# Altium project DC_DC_BuckConverter.PrjPcb
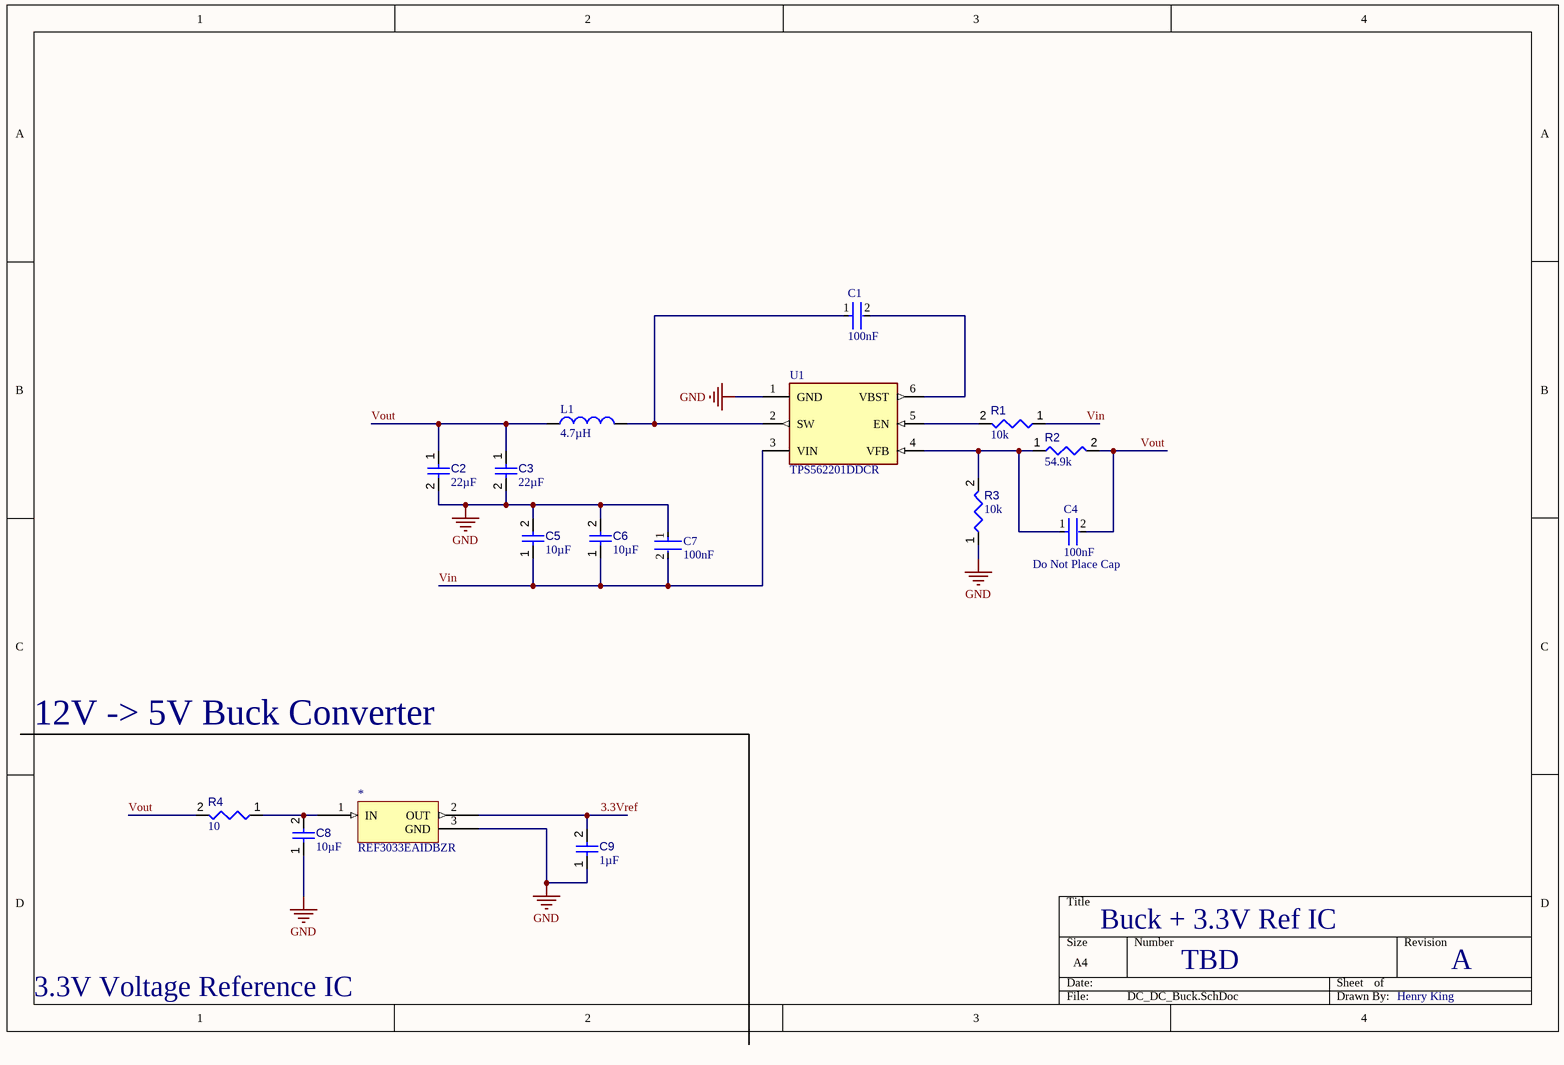
[diagram p0: DC_DC_Buck.SchDoc]
1 sheet, 16 parts. Net scope: global (net labels, ports and power ports of the same name join across sheets).
Board file: DC_DC_Buck.PcbDoc

## Sheet DC_DC_Buck.SchDoc
size A4; SheetNumber: 1; SheetTotal: 1; SPICEModelCacheDHIRAOPG: <root> / <DocumentId>DHIRAOPG</DocumentId> / <CacheFrame Number="0"> / <Model Name="tmk316bbj226_l-t" Kind="CKT"> / <Text>* TMK316BBJ226_L-T     SPICE MODEL  ( General Type ) / *-------------------------------------------------------------------------------------------------------- / * Model Generated by TAIYO YUDEN Corporation (http://www.ty-top.com) / * Version 1.0 / * TAIYO YUDEN Control No. 170508_120221 / * Copyright(c) 2012 TAIYO YUDEN CO.,LTD. All Rights Reserved. / *-------------------------------------------------------------------------------------------------------- / * / * Products Name : Multilayer Ceramic Capacitors / * / * Characteristics : / *     Capacitance : 22 uF , Rated Voltage : 25V , TCC : X5R / *     Case Size : 3.2 x 1.6 / 0.126 x 0.063 [mm/inch] , Thickness : 1.6 / 0.063 [mm/inch] / *     (Conditions: Temperature = 25 degC , DC Bias Current/Voltage = 0A / 0V) / * / * Frequency Range : 40Hz - 3GHz / * / * External Node Assignments : / * / *  1  o---| |---o  2 / * / *-------------------------------------------------------------------------------------------------------- / .SubCkt TMK316BBJ226_L-T 1 2 / **************************** / C0 1 110 19.537u / Cm 1 101 0.98196u / C1 101 102 0.83388u / Rc1 101 102 368.18 / C2 102 103 0.44752u / Rc2 102 103 74.6 / C3 103 110 0.046385u / Rc3 103 110 13.615 / C2m 1 301 3.0332u / C21 301 302 3.2875u / Rc21 301 302 2.2174k / C22 302 303 5.0633u / Rc22 302 303 433.75 / C23 303 304 6.7742u / Rc23 303 304 145.4 / C24 304 305 6.7617u / Rc24 304 305 32.051 / C25 305 306 2.0909u / Rc25 305 306 52.07 / C26 306 307 2.9416u / Rc26 306 307 24.08 / C27 307 308 0.96599u / Rc27 307 308 13.816 / C28 308 309 0.086103u / Rc28 308 309 2.4667 / C29 309 110 2479.6p / Rc29 309 110 10.77 / Rp0 1 110 4.54545454545455Meg / L0 110 120 0.24744n / Lm 120 130 0.30645n / L1 120 121 0.1747n / RL1 121 130 8.1178 / L2 120 122 0.25932n / RL2 122 130 0.21997 / L3 120 123 0.87295n / RL3 123 130 0.1881 / CR 120 124 3.0421u / LR 124 125 0.73527n / RR 125 130 16.273m / CL 130 140 0.81467p / LL 130 140 0.24933n / RL 130 140 34.879 / Rs 140 2 2.6209m / **************************** / .ends TMK316BBJ226_L-T</Text> / </Model> / </CacheFrame> / </root>

### Parts
*  REF3033EAIDBZR  [SOT95P235X112-3N]
C1  value 100nF  [FP-GRM188-0_1-e0_2_0_5-IPC_B]  (hidden comment: Capacitor 100nF 0603)
C2  value 22µF  [FP-1206-L_3_2_0_3-W_1_6_0-IPC_B]  (hidden comment: 22uf Capacitor 1206)
C3  value 22µF  [FP-1206-L_3_2_0_3-W_1_6_0-IPC_B]  (hidden comment: 22uf Capacitor 1206)
C4  value 100nF  [FP-GRM188-0_1-e0_2_0_5-IPC_B]  (hidden comment: Capacitor 100nF 0603)
C5  value 10µF  [CAPC2012X135N]  (hidden comment: CL21B106KOQNNNE)
C6  value 10µF  [CAPC2012X135N]  (hidden comment: CL21B106KOQNNNE)
C7  value 100nF  [FP-GRM188-0_1-e0_2_0_5-IPC_B]  (hidden comment: Capacitor 100nF 0603)
C8  value 10µF  [CAPC2012X135N]  (hidden comment: CL21B106KOQNNNE)
C9  value 1µF  [CAPC1608X90X35ML15T15]  (hidden comment: Capacitor 1uF +/- 10% 16V 0603)
L1  value 4.7µH  [INDM5252X300N]  (hidden comment: LMLP0506M4R7DTAS)
R1  value 10k  [RESC1608X55X25ML10T15]  (hidden comment: Resistor 10k +/-1% 0603 100 mW)
R2  value 54.9k  [FP-RMCF0603-IPC_B]  (hidden comment: 54.9kohm 0603 Resistor)
R3  value 10k  [RESC1608X55X25ML10T15]  (hidden comment: Resistor 10k +/-1% 0603 100 mW)
R4  value 10  [RESC0402(1005)_L]  (hidden comment: Resistor 10R  +/-1 % 0402 63 mW)
U1  TPS562201DDCR  [FP-DDC0006A-MFG]

### Nets
GND: *.3(GND) C2.2 C3.2 C5.2 C6.2 C7.1 C8.1 C9.1 R3.1 U1.1(GND)
3.3Vref: *.2(OUT) C9.2
Vin: C5.1 C6.1 C7.2 R1.1 U1.3(VIN)
Vout: C2.1 C3.1 C4.2 L1.1 R2.2 R4.2
Net*_1: *.1(IN) C8.2 R4.1
NetC1_1: C1.1 L1.2 U1.2(SW)
NetC1_2: C1.2 U1.6(VBST)
NetC4_1: C4.1 R2.1 R3.2 U1.4(VFB)
NetR1_2: R1.2 U1.5(EN)

### Notes on the sheet
- (near C4) Do Not Place Cap
- 12V -> 5V Buck Converter
- Buck + 3.3V Ref IC
- TBD
- A
- 3.3V Voltage Reference IC
- Henry King

### Library data of the parts
* = CMP-019-00053-1: 15 ppm°/C drift, 27uA Iq in SOT-23-3 package series voltage reference 3-SOT-23 -40 to 125; Output Voltage: 3.3V; Case/Package: SOT-23; Pins: 3; Min Operating Temperature: -40°C; Max Operating Temperature: 125°C
C1 C4 C7 = CMP-001-00084-1: 100V 100nF X7R ±10% 0603 Multilayer Ceramic Capacitors MLCC - SMD/SMT ROHS; Tolerance: 10%; Pins: 2; Max Operating Temperature: 125°C; Mounting Technology: Surface Mount; Voltage Rating: 100V; Case/Package: 0603; Min Operating Temperature: -55°C
C2 C3 = CMP-001-00087-1: CAP CER 22UF 25V X5R 1206 / High Value Multilayer Ceramic Capacitors (High dielectric type); Tolerance: 20%; Mounting Technology: Surface Mount; Max Operating Temperature: 85°C; Case/Package: 1206; Min Operating Temperature: -55°C; Voltage Rating: 25V
C5 C6 C8 = CMP-001-00090-1: 16V 10uF X7R 卤10% 0805 Multilayer Ceramic Capacitors MLCC - SMD/SMT ROHS; Tolerance: 10%; Mounting Technology: Surface Mount; Min Operating Temperature: -55°C; Max Operating Temperature: 125°C; Voltage Rating: 16V; Case/Package: 0805
C9 = CMP-001-00004-6: Chip Capacitor, 1 uF, +/- 10%, 16 V, 0603 (1608 Metric); Capacitor Type: Ceramic; Mounting Technology: SM; RoHS Compliant: True; Min Operating Temperature: -55°C; Case/Package: 0603; Pins: 2; Voltage Rating: 16V; Max Operating Temperature: 125°C; Tolerance: 10%
L1 = CMP-006-00022-1: Inductor Power Wirewound 4.7uH 20% 100KHz Ferrite 3.5A 77.5mOhm DCR; Tolerance: 20%; Max Operating Temperature: 155°C; Min Operating Temperature: -55°C; Max Current Rating: 3.5A; Case/Package: 2120
R1 R3 = CMP-009-00017-5: Chip Resistor, 10 KOhm, +/- 1%, 01 W, -55 to 155 degC, 0603 (1608 Metric); Voltage Rating: 50V; Power: 100mW; RoHS Compliant: True; Min Operating Temperature: -55°C; Pins: 2; Case/Package: 0603; Mounting Technology: SM; Max Operating Temperature: 155°C; Tolerance: 1%
R2 = CMP-009-00180-1: Res Thick Film 0603 54.9K Ohm 1% 0.1W(1/10W) ±100ppm/C Pad SMD Automotive T/R; Voltage Rating: 75V; Tolerance: 1%; Mounting Technology: Surface Mount; Case/Package: 0603; Max Operating Temperature: 155°C; Min Operating Temperature: -55°C
R4 = CMP-009-00152-3: Chip Resistor, 10 Ohms, +/-1 %, 63 mW, -55 to 155 degC, 0402; Tolerance: 1%; Power: 63mW; Pins: 2; Max Operating Temperature: 155°C; Min Operating Temperature: -55°C; Case/Package: 0402
U1 = CMP-011-00013-2: Buck 580KHz Adjustable SOT-23-THIN SMD mount 1.1mm(height); Manufacturer Lifecycle Status: ACTIVE; Max Output current: 2A; Nominal Supply Current: 380µA; Number of Channels: 1; Output Voltage: 7V; Max Duty Cycle: 75%; Max Supply Voltage: 17V; Quiescent Current: 400µA; Max Junction Temperature (Tj): 125°C; Min Input Voltage: 4.5V; Max Operating Temperature: 125°C; Output Type: Adjustable; Mounting Technology: Surface Mount; Case/Package: SOT; Min Operating Temperature: -40°C; Length: 2.9mm; Contact Plating: Tin; Lead Free: Lead Free; Thickness: 870µm; Output Current: 2A; Number of Outputs: 1; Lifecycle Status: Production; RoHS: Compliant; Operating Supply Voltage: 17V; Pins: 6; Topology: Buck; Switching Frequency: 580kHz; Height: 1.1mm; Width: 1.6mm